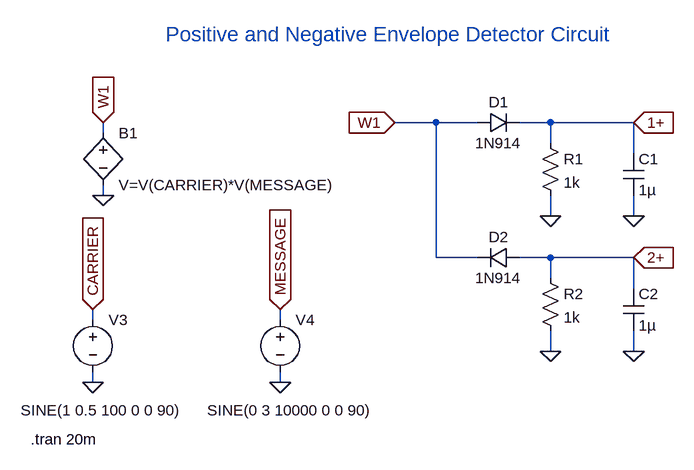
[diagram p0: schematic ext_env_detector_ltspice.asc]
ext_env_detector_ltspice.asc, the LTspice schematic file:
Version 4
SHEET 1 880 724
WIRE 160 112 96 112
WIRE 224 112 160 112
WIRE 336 112 288 112
WIRE 464 112 336 112
WIRE -352 128 -352 112
WIRE 336 144 336 112
WIRE 464 160 464 112
WIRE -352 224 -352 208
WIRE 336 256 336 224
WIRE 464 256 464 224
WIRE 160 320 160 112
WIRE 224 320 160 320
WIRE 336 320 288 320
WIRE 464 320 336 320
WIRE 336 352 336 320
WIRE 464 368 464 320
WIRE -368 416 -368 400
WIRE -80 416 -80 400
WIRE 336 464 336 432
WIRE 464 464 464 432
WIRE -368 512 -368 496
WIRE -80 512 -80 496
FLAG 336 256 0
FLAG 464 256 0
FLAG 96 112 W1
IOPIN 96 112 In
FLAG 464 112 1+
IOPIN 464 112 In
FLAG -352 224 0
FLAG -352 112 W1
IOPIN -352 112 In
FLAG 336 464 0
FLAG 464 464 0
FLAG 464 320 2+
IOPIN 464 320 In
FLAG -368 512 0
FLAG -80 512 0
FLAG -368 400 CARRIER
IOPIN -368 400 In
FLAG -80 400 MESSAGE
IOPIN -80 400 In
SYMBOL diode 224 128 R270
WINDOW 0 32 32 VTop 2
WINDOW 3 0 32 VBottom 2
SYMATTR InstName D1
SYMATTR Value 1N914
SYMBOL res 320 128 R0
SYMATTR InstName R1
SYMATTR Value 1k
SYMBOL cap 448 160 R0
SYMATTR InstName C1
SYMATTR Value 1µ
SYMBOL bv -352 112 R0
SYMATTR InstName B1
SYMATTR Value V=V(CARRIER)*V(MESSAGE)
SYMBOL diode 288 336 M270
WINDOW 0 32 32 VTop 2
WINDOW 3 0 32 VBottom 2
SYMATTR InstName D2
SYMATTR Value 1N914
SYMBOL res 320 336 R0
SYMATTR InstName R2
SYMATTR Value 1k
SYMBOL cap 448 368 R0
SYMATTR InstName C2
SYMATTR Value 1µ
SYMBOL voltage -368 400 R0
WINDOW 3 -111 155 Left 2
WINDOW 123 0 0 Left 0
WINDOW 39 0 0 Left 0
SYMATTR Value SINE(1 0.5 100 0 0 90)
SYMATTR InstName V3
SYMBOL voltage -80 400 R0
WINDOW 3 -112 155 Left 2
WINDOW 123 0 0 Left 0
WINDOW 39 0 0 Left 0
SYMATTR Value SINE(0 3 10000 0 0 90)
SYMATTR InstName V4
TEXT -256 -24 Left 3 ;Positive and Negative Envelope Detector Circuit
TEXT -464 600 Left 2 !.tran 20m

The netlist it stands for:
* ext_env_detector_ltspice.asc
D1 W1 1+ 1N914
R1 1+ 0 1k
C1 1+ 0 1µ
B1 W1 0 V=V(CARRIER)*V(MESSAGE)
D2 2+ W1 1N914
R2 2+ 0 1k
C2 2+ 0 1µ
V3 CARRIER 0 SINE(1 0.5 100 0 0 90)
V4 MESSAGE 0 SINE(0 3 10000 0 0 90)
.model D D
.lib standard.dio
* Positive and Negative Envelope Detector Circuit
.tran 20m
.backanno
.end